# EAGLE schematic mainboard (EAGLE 9.3.2)
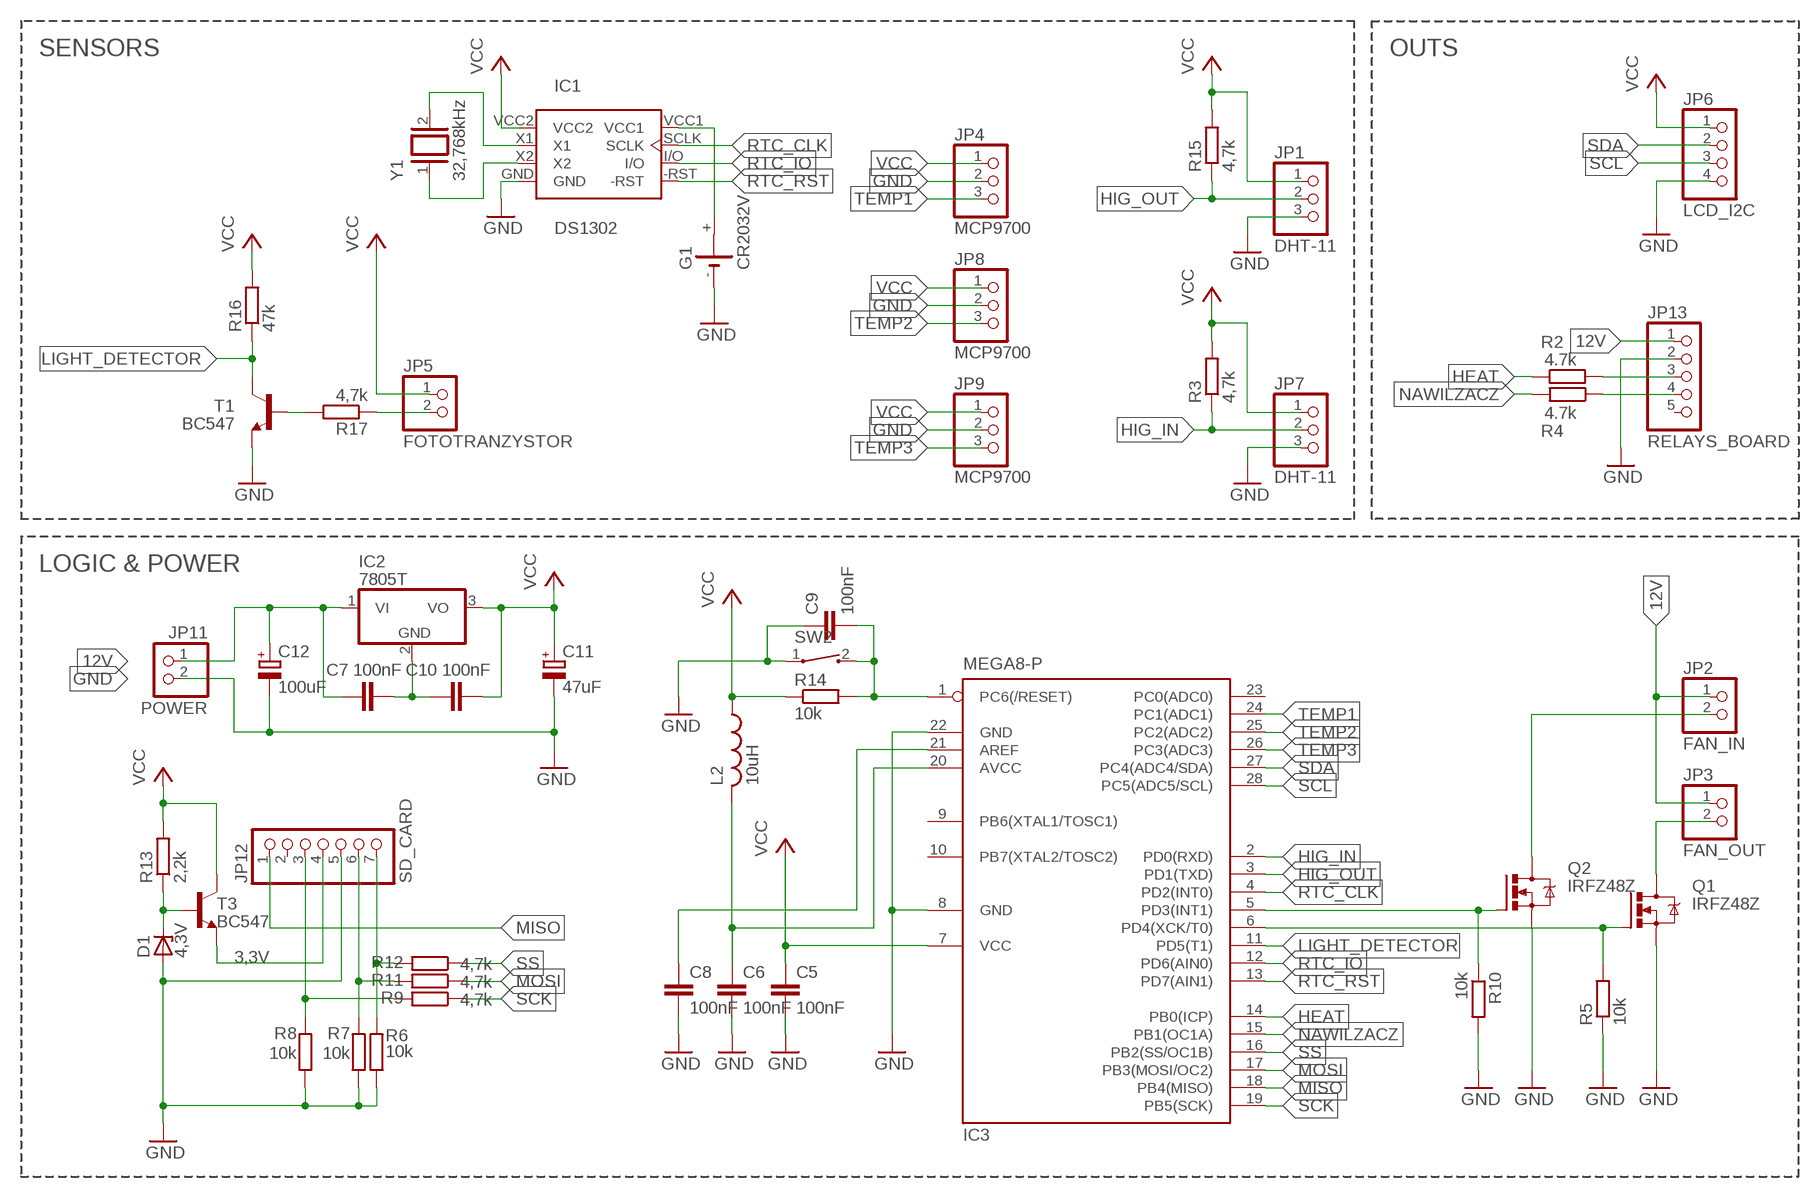
[diagram p0: schematic, sheet 1]

## Parts
C5  100nF  C-EU050-030X075  [C050-030X075]
C6  100nF  C-EU050-030X075  [C050-030X075]
C7  100nF  C-EU050-024X044  [C050-024X044]
C8  100nF  C-EU050-030X075  [C050-030X075]
C9  100nF  C-EU050-030X075  [C050-030X075]
C10  100nF  C-EU050-024X044  [C050-024X044]
C11  47uF  CPOL-EUE2.5-6  [E2,5-6]
C12  100uF  CPOL-EUE2.5-6  [E2,5-6]
D1  4,3V  ZENER-DIODEC1702-15  [C1702-15]
G1  CR2032V  [CR2032V]
IC1  DS1302  [DIL08]
IC2  7805T  [TO220H]
IC3  MEGA8-P  [DIL28-3]
JP1  DHT-11  PINHD-1X3  [1X03]
JP2  FAN_IN  PINHD-1X2  [1X02]
JP3  FAN_OUT  PINHD-1X2  [1X02]
JP4  MCP9700  PINHD-1X3  [1X03]
JP5  FOTOTRANZYSTOR  PINHD-1X2  [1X02]
JP6  LCD_I2C  PINHD-1X4  [1X04]
JP7  DHT-11  PINHD-1X3  [1X03]
JP8  MCP9700  PINHD-1X3  [1X03]
JP9  MCP9700  PINHD-1X3  [1X03]
JP11  POWER  PINHD-1X2  [1X02]
JP12  SD_CARD  PINHD-1X7  [1X07]
JP13  RELAYS_BOARD  PINHD-1X5  [1X05]
L2  10uH  L-US0204/7  [0204/7]
Q1  IRFZ48Z  [TO220BH]
Q2  IRFZ48Z  [TO220BH]
R2  4.7k  R-EU_0207/10  [0207/10]
R3  4,7k  R-EU_0207/10  [0207/10]
R4  4.7k  R-EU_0207/10  [0207/10]
R5  10k  R-EU_0207/10  [0207/10]
R6  10k  R-EU_0207/10  [0207/10]
R7  10k  R-EU_0207/10  [0207/10]
R8  10k  R-EU_0207/10  [0207/10]
R9  4,7k  R-EU_0207/10  [0207/10]
R10  10k  R-EU_0207/10  [0207/10]
R11  4,7k  R-EU_0207/10  [0207/10]
R12  4,7k  R-EU_0207/10  [0207/10]
R13  2,2k  R-EU_0207/10  [0207/10]
R14  10k  R-EU_0204/7  [0204/7]
R15  4,7k  R-EU_0207/10  [0207/10]
R16  47k  R-EU_0207/10  [0207/10]
R17  4,7k  R-EU_0207/10  [0207/10]
SW2  CT10-XXXX-G4  [CT10-XXXX-G4]
T1  BC547  [TO92]
T3  BC547  [TO92]
Y1  32,768kHz  XTAL/S  [QS]

## Nets
3,3V: JP12.4 T3.1(E)
12V: C7.1 C12.+ IC2.1(VI) JP2.1 JP3.1 JP11.1 JP13.1
GND: C5.2 C6.2 C8.2 C9.1 C11.- C12.- D1.A G1.- IC1.GND IC3.8(GND) IC3.22(GND) JP1.3 JP4.2 JP6.4 JP7.3 JP8.2 JP9.2 JP11.2 JP12.5 JP13.2 Q1.S Q2.S R5.1 R6.1 R7.1 R8.1 R10.2 SW2.1 T1.1(E)
HEAT: IC3.14(PB0(ICP)) R2.1
HIG_IN: IC3.2(PD0(RXD)) JP7.2 R3.1
HIG_OUT: IC3.3(PD1(TXD)) JP1.2 R15.1
LIGHT_DETECTOR: IC3.6(PD4(XCK/T0)) IC3.11(PD5(T1)) Q1.G R5.2 R16.1 T1.3(C)
MISO: IC3.18(PB4(MISO)) JP12.1
MOSI: IC3.17(PB3(MOSI/OC2)) R11.1
N$1: JP13.3 R2.2
N$2: IC1.X1 Y1.2
N$3: JP13.4 R4.1
N$4: C9.2 IC3.1(PC6(/RESET)) R14.2 SW2.2
N$5: JP5.2 R17.1
N$6: C6.1 IC3.20(AVCC) L2.2
N$7: C8.1 IC3.21(AREF)
N$8: IC1.X2 Y1.1
N$9: C7.2 C10.1 IC2.2(GND)
N$10: IC3.5(PD3(INT1)) Q2.G R10.1
N$11: D1.C R13.1 T3.2(B)
N$13: R17.2 T1.2(B)
N$14: JP2.2 Q2.D
N$22: JP12.7 R6.2 R12.2
N$24: JP3.2 Q1.D
N$27: JP12.6 R7.2 R11.2
N$33: JP12.3 R8.2 R9.2
NAWILZACZ: IC3.15(PB1(OC1A)) R4.2
RTC_CLK: IC1.SCLK IC3.4(PD2(INT0))
RTC_IO: IC1.I/O IC3.12(PD6(AIN0))
RTC_RST: IC1.-RST IC3.13(PD7(AIN1))
SCK: IC3.19(PB5(SCK)) R9.1
SCL: IC3.28(PC5(ADC5/SCL)) JP6.3
SDA: IC3.27(PC4(ADC4/SDA)) JP6.2
SS: IC3.16(PB2(SS/OC1B)) R12.1
TEMP1: IC3.24(PC1(ADC1)) JP4.3
TEMP2: IC3.25(PC2(ADC2)) JP8.3
TEMP3: IC3.26(PC3(ADC3)) JP9.3
VCC: C5.1 C10.2 C11.+ IC1.VCC2 IC2.3(VO) IC3.7(VCC) JP1.1 JP4.1 JP5.1 JP6.1 JP7.1 JP8.1 JP9.1 L2.1 R3.2 R13.2 R14.1 R15.2 R16.2 T3.3(C)
VCC1: G1.+ IC1.VCC1
Unconnected: G1.+@1(+) IC3.9(PB6(XTAL1/TOSC1)) IC3.10(PB7(XTAL2/TOSC2)) IC3.23(PC0(ADC0)) JP12.2 JP13.5

## Notes on the sheet
- SENSORS | OUTS
- LOGIC & POWER

## Library data of the parts
C5-C10 = rcl:C-EU: CAPACITOR, European symbol
C11 C12 = rcl:CPOL-EU: POLARIZED CAPACITOR, European symbol
D1 = diode:ZENER-DIODE: Z-Diode
G1 = battery:CR2032V: LI BATTERY Varta
IC1 = ds1302:DS1302: Real-time clock (RTC) counts seconds, minutes hours, date of the month, month, day of the week, and year with leap-year compensation valid up to 2100
IC2 = linear:78*: Positive VOLTAGE REGULATOR Source: http://cache.national.com/ds/LM/LM78L05.pdf http://www.fairchildsemi.com/ds/LM/LM7805.pdf
IC3 = atmel:MEGA8-P: MICROCONTROLLER 8 Kbytes FLASH, 1 kbytes SRAM, 512 bytes EEPROM, USART, 4-channel 10 bit ADC, 2-channel 8 bit ADC Pin compatible with Atmega48, ATMega88, ATMega168 Source: avr.lbr; OC_FARNELL: unknown; OC_NEWARK: unknown
JP1 JP4 JP7-JP9 = pinhead:PINHD-1X3: PIN HEADER
JP2 JP3 JP5 JP11 = pinhead:PINHD-1X2: PIN HEADER
JP6 = pinhead:PINHD-1X4: PIN HEADER
JP12 = pinhead:PINHD-1X7: PIN HEADER
JP13 = pinhead:PINHD-1X5: PIN HEADER
L2 = rcl:L-US: INDUCTOR, American symbol
Q1 Q2 = transistor-power:IRFZ48: N Channel HEXFET® Power MOSFET Logic Level Source: http://www.irf.com/product-info/datasheets/data/irfz48z.pdf
R2-R17 = rcl:R-EU_: RESISTOR, European symbol
SW2 = switch-coto:CT10-XXXX-: CT10 Series Molded Switch Source: www.cotorelay.com .. Coto_Technology__CT10-1530-G1.pdf
T1 T3 = transistor:BC547: NPN TRANSISTOR
Y1 = special:XTAL/S: CRYSTAL